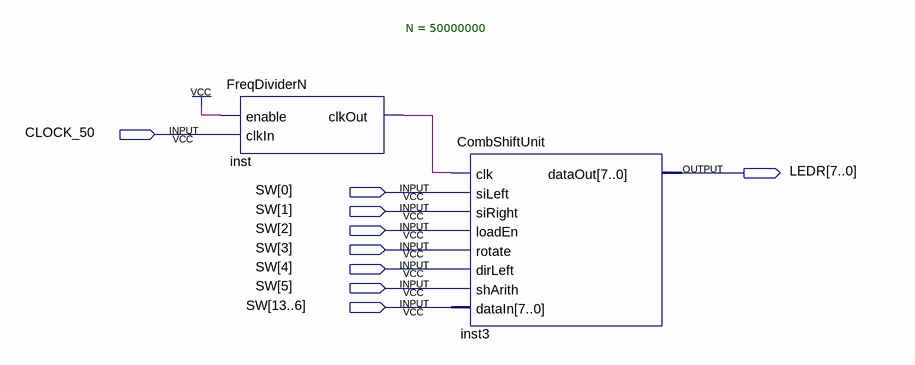
[diagram p0: schematic sheet]
// Quartus schematic CombShiftUnit_Demo.bdf as structural Verilog: 2 symbols, 9 pins
module CombShiftUnit_Demo (
  input  CLOCK_50,
  input  [13:0] SW,
  output [7:0] LEDR
);

  wire inst_clkout;

  FreqDividerN #(.N(50000000)) inst (.enable(1'b1), .clkIn(CLOCK_50), .clkOut(inst_clkout));
  CombShiftUnit inst3 (
    .clk(inst_clkout), .siLeft(SW[0]), .siRight(SW[1]), .loadEn(SW[2]), .rotate(SW[3]), .dirLeft(SW[4]),
    .shArith(SW[5]), .dataIn(SW[13:6]), .dataOut(LEDR));
endmodule
